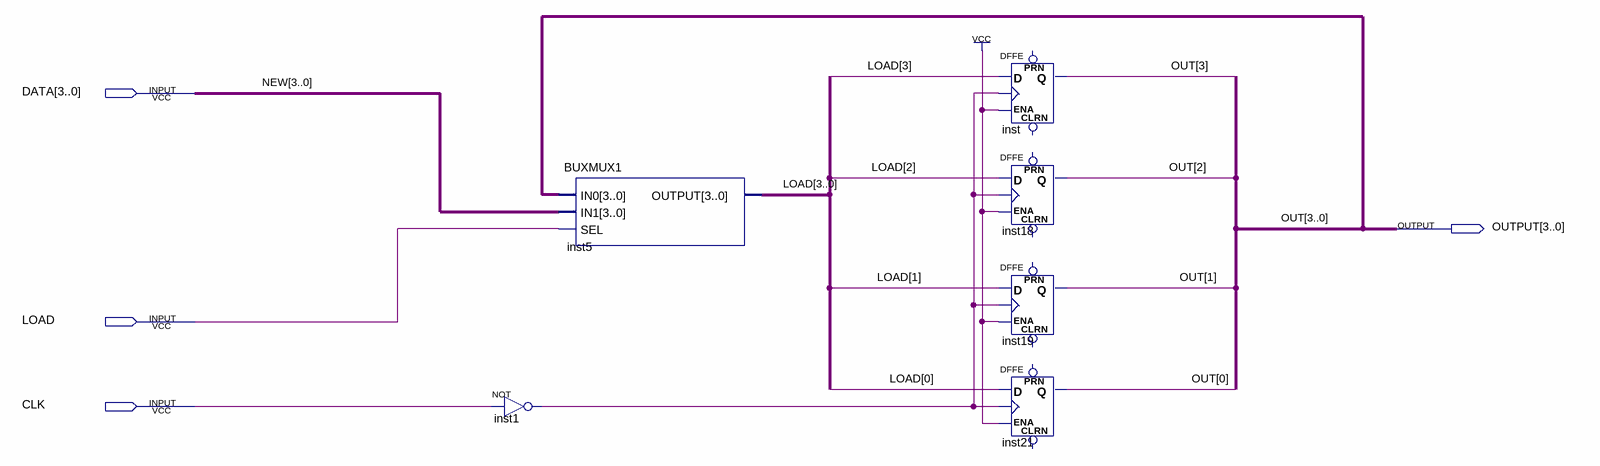
[diagram p0: schematic sheet]
// Quartus schematic REG4.bdf as structural Verilog: 6 symbols, 4 pins
module REG4 (
  input  [3:0] DATA,
  input  LOAD,
  input  CLK,
  output [3:0] OUTPUT
);

  wire inst1_out;
  wire [3:0] LOAD_bus;

  not inst1 (inst1_out, CLK);
  BUXMUX1 inst5 (.IN0(OUTPUT), .IN1(DATA), .SEL(LOAD), .OUTPUT(LOAD_bus));
  DFFE inst (.D(LOAD_bus[3]), .CLK(inst1_out), .ENA(1'b1), .Q(OUTPUT[3]));  // open: PRN, CLRN
  DFFE inst18 (.D(LOAD_bus[2]), .CLK(inst1_out), .ENA(1'b1), .Q(OUTPUT[2]));  // open: PRN, CLRN
  DFFE inst19 (.D(LOAD_bus[1]), .CLK(inst1_out), .ENA(1'b1), .Q(OUTPUT[1]));  // open: PRN, CLRN
  DFFE inst21 (.D(LOAD_bus[0]), .CLK(inst1_out), .ENA(1'b1), .Q(OUTPUT[0]));  // open: PRN, CLRN

  // Other names for the same wires on the sheet: NEW[3:0] = DATA; OUT[3:0] = OUTPUT
endmodule
